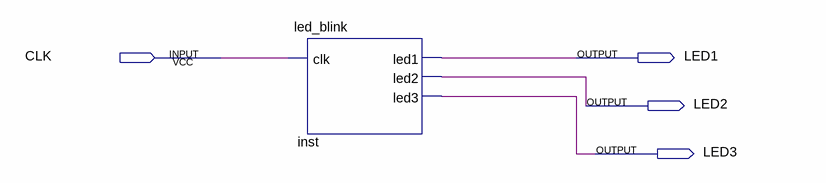
[diagram p0: schematic sheet]
// Quartus schematic Blinking_3_LEDs.bdf as structural Verilog: 1 symbols, 4 pins
module Blinking_3_LEDs (
  input  CLK,
  output LED1,
  output LED2,
  output LED3
);

  led_blink inst (.clk(CLK), .led1(LED1), .led2(LED2), .led3(LED3));
endmodule
